# EAGLE design vco__amp_twg (EAGLE 9.6.2)
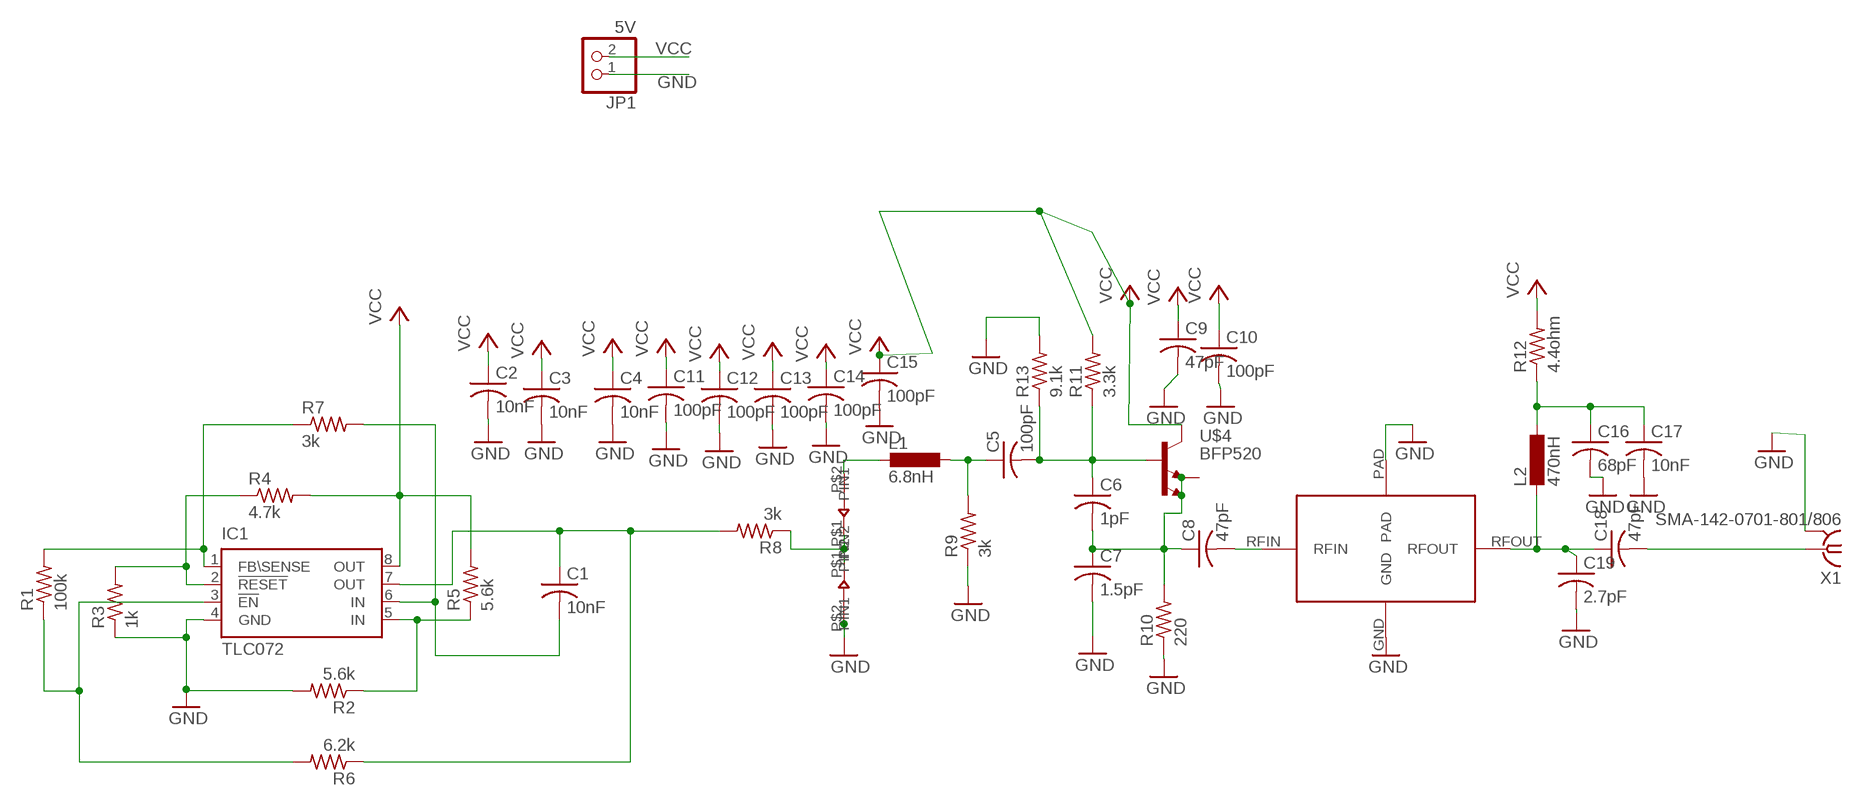
[diagram p0: schematic, sheet 1]

## Parts
C1  10nF  C-USC0603  [C0603]
C2  10nF  C-USC0603  [C0603]
C3  10nF  C-USC0603  [C0603]
C4  10nF  C-USC0603  [C0603]
C5  100pF  C-USC0603  [C0603]
C6  1pF  C-USC0603  [C0603]
C7  1.5pF  C-USC0603  [C0603]
C8  47pF  C-USC0603  [C0603]
C9  47pF  C-USC0603  [C0603]
C10  100pF  C-USC0603  [C0603]
C11  100pF  C-USC0603  [C0603]
C12  100pF  C-USC0603  [C0603]
C13  100pF  C-USC0603  [C0603]
C14  100pF  C-USC0603  [C0603]
C15  100pF  C-USC0603  [C0603]
C16  68pF  C-USC0603  [C0603]
C17  10nF  C-USC0603  [C0603]
C18  47pF  C-USC0603  [C0603]
C19  2.7pF  C-USC0603  [C0603]
IC1  TLC072  TPS77301  [SOP-08]
JP1  5V  PINHD-1X2  [1X02]
L1  6.8nH  L-EUL0603  [L0603]
L2  470nH  L-EUL0603  [L0603]
R1  100k  R-US_R0603  [R0603]
R2  5.6k  R-US_R0603  [R0603]
R3  1k  R-US_R0603  [R0603]
R4  4.7k  R-US_R0603  [R0603]
R5  5.6k  R-US_R0603  [R0603]
R6  6.2k  R-US_R0603  [R0603]
R7  3k  R-US_R0603  [R0603]
R8  3k  R-US_R0603  [R0603]
R9  3k  R-US_R0603  [R0603]
R10  220  R-US_R0603  [R0603]
R11  3.3k  R-US_R0603  [R0603]
R12  4.4ohm  R-US_R0603  [R0603]
R13  9.1k  R-US_R0603  [R0603]
U$1  BBY5702  [BBY5702]
U$2  MMG3001  [SOT-89]
U$4  BFP520  [SOT343]
U$5  BBY5702  [BBY5702]
X1  SMA-142-0701-801/806  [J502-ND-142-0701-801/806]

## Nets
GND: C2.2 C3.2 C4.2 C7.2 C9.2 C10.2 C11.2 C12.2 C13.2 C14.2 C15.2 C16.2 C17.2 C19.2 IC1.4(GND) JP1.1 R2.2 R3.1 R9.1 R10.1 R13.2 U$2.GND U$2.PAD U$5.P$2(PIN2) X1.G@1 X1.G@2 X1.G@3 X1.G@4
N$1: IC1.1(FB\SENSE) R1.2 R7.1
N$2: IC1.3(!EN) R1.1 R6.2
N$3: C8.2 U$2.RFIN
N$4: IC1.5(IN) R2.1 R5.1
N$5: IC1.2(!RESET) R3.2 R4.1
N$6: L1.2 U$1.P$2(PIN2)
N$7: C1.1 IC1.7(OUT) R6.1 R8.2
N$8: C1.2 IC1.6(IN) R7.2
N$9: C5.1 L1.1 R9.2
N$10: C16.1 C17.1 L2.1 R12.1
N$11: C5.2 C6.1 R11.1 R13.1 U$4.1(B)
N$12: R8.1 U$1.P$1(PIN1) U$5.P$1(PIN1)
N$15: C18.1 C19.1 L2.2 U$2.RFOUT
N$16: C18.2 X1.1
N$17: C6.2 C7.1 C8.1 R10.2 U$4.2(E1) U$4.4(E2)
VCC: C2.1 C3.1 C4.1 C9.1 C10.1 C11.1 C12.1 C13.1 C14.1 C15.1 IC1.8(OUT) JP1.2 R4.2 R5.2 R11.2 R12.2 U$4.3(C)

## Library data of the parts
C1-C18 = resistor:C-US: CAPACITOR, American symbol
C19 = rcl-2:C-US: CAPACITOR, American symbol
IC1 = texas:TPS773*: 250-mA LDO REGULATORS WITH RESET OUTPUT WITH 8-PIN MSOP PACKAGING Source: http://focus.ti.com/lit/ds/symlink/tps77333.pdf; MF: TEXAS INSTRUMENT CONNECTORS; MPN: TPS77301DGK; OC_FARNELL: 1510194; OC_NEWARK: 77C1213
JP1 = pinhead:PINHD-1X2: PIN HEADER; JUMPER: Suuply
L1 L2 = rcl-2:L-EU: INDUCTOR, European symbol
R1-R13 = resistor:R-US_: RESISTOR, American symbol
U$1 U$5 = BBY57-02W:BBY5702
U$2 = mmg3001:MMG3001
U$4 = IFXRFNPN:BFP520
X1 = con-coax:SMA-: SMA 50 Ohm End Launch Jack Receptacle - Round Contact Johnson Components Source: www.johnsoncomponents.com .. J502-ND.pdf; MF: JOHNSON COMPONENTS; MPN: 142-0701-801; OC_FARNELL: 1608592; OC_NEWARK: 90F2624

## Net classes
0 default: width 0.305 mm, drill 0.508 mm, clearance 0.254 mm

## Board
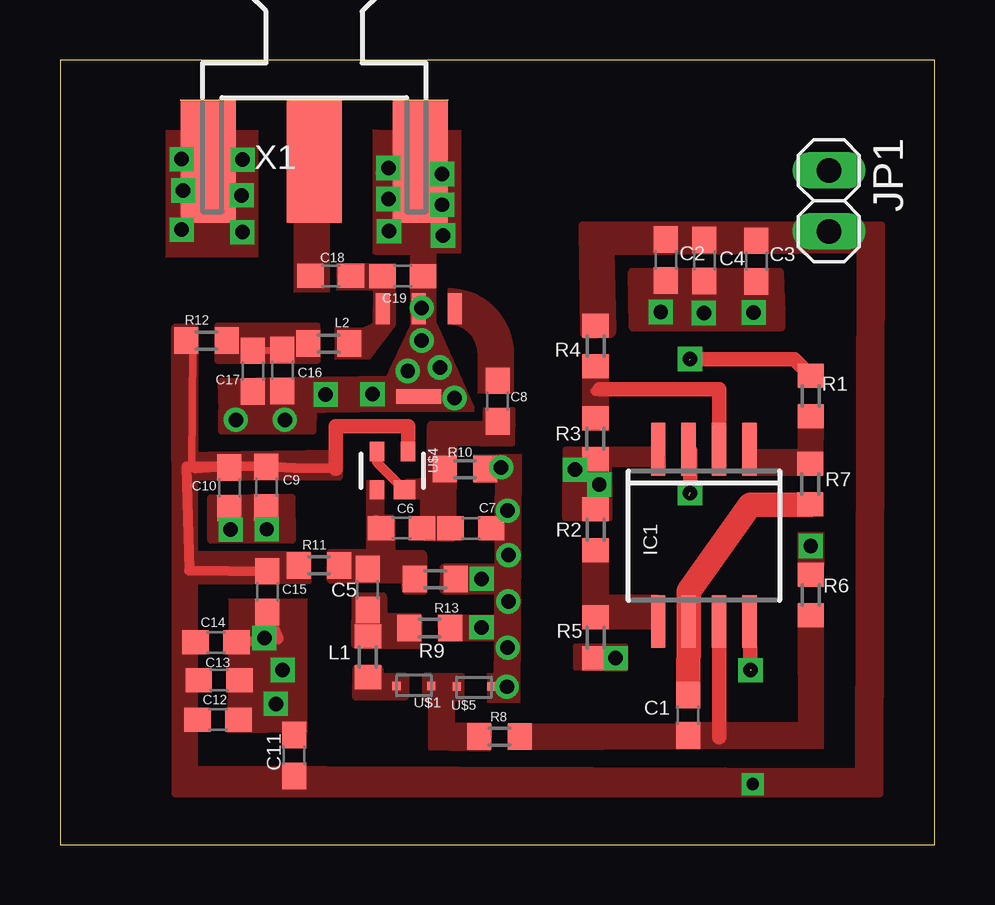
[diagram p1: board, top side]
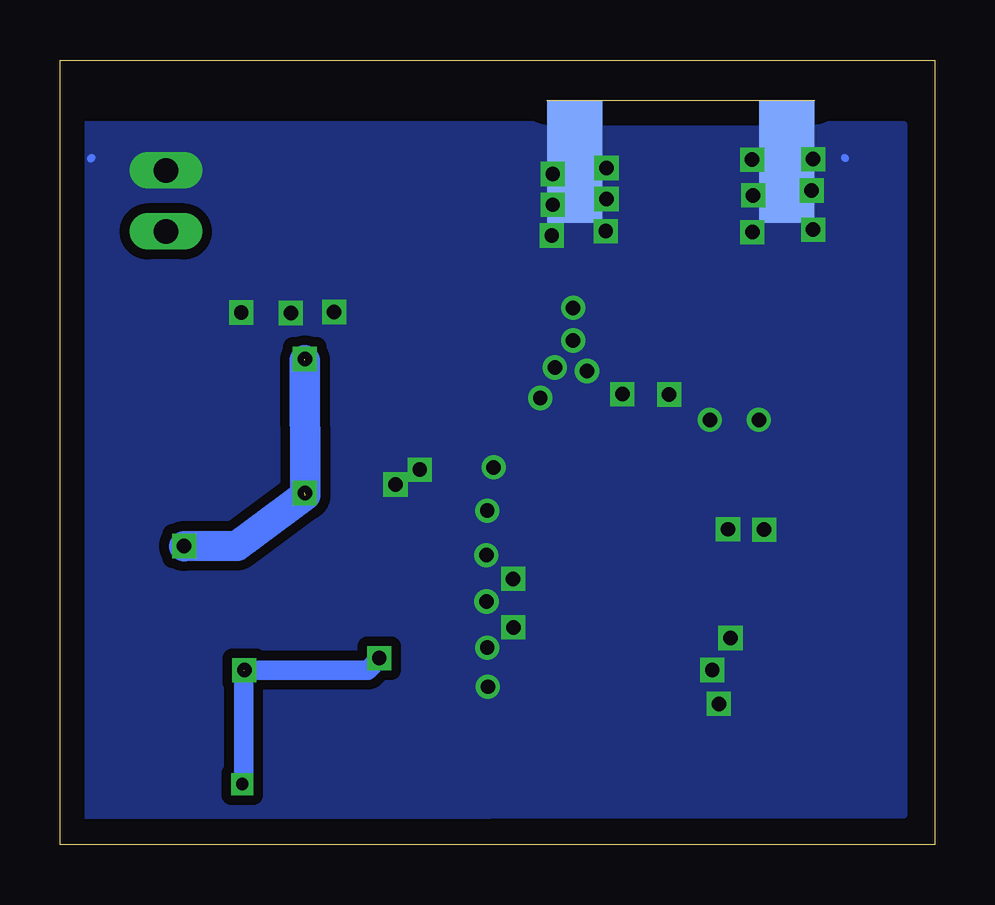
[diagram p2: board, bottom side, seen from below]

Size 36.45 x 32.7 mm. Coordinates in mm from the lower left corner, seen from the top.
Outline: 0,0 36.45,0 36.45,32.7 0,32.7 0,0
Copper layers (1*16): Top 0.035mm / dielectric 1.5mm / Bottom 0.035mm
Design rules "default *": minimum track width 6mil, minimum drill 15mil, track to track 6mil, track to pad 6mil, pad to pad 6mil, via to via 6mil, smd to smd 0mil, copper to edge 40mil, drill to drill 8mil, minimum pad ring 10mil, minimum via ring 8mil, stop-mask expansion 4mil, vias tented up to drill 0mil, thermal gap 10mil

### Footprints (pad centres in the part's own frame; a part is rotated, then mirrored left to right if it is on the bottom)
C0603 = smd 1.1 x 1: 1 -0.85,0; 2 0.85,0
SOP-08 = smd 0.6 x 2.2: 1 -1.905,-3.6; 2 -0.635,-3.6; 3 0.635,-3.6; 4 1.905,-3.6; 5 1.905,3.575; 6 0.635,3.575; 7 -0.635,3.575; 8 -1.905,3.575
1X02 = drill 1.016 long: 1 -1.27,0; 2 1.27,0
L0603 = smd 1 x 1.1: 1 -0.85,0; 2 0.85,0
R0603 = smd 1 x 1.1: 1 -0.85,0; 2 0.85,0
BBY5702 = smd 0.35 x 0.35: P$1 0,0.73; P$2 0,-0.72
SOT-89 = smd 0.58 x 1.3: GND 0,-2; RFIN -1.5,-2; RFOUT 1.5,-2 | smd 1.87 x 0.6: PAD 0,1.65
SOT343 = smd 0.6 x 0.8: 1 -0.65,-0.8; 3 0.65,0.8; 4 -0.65,0.8 | smd 0.9 x 0.8: 2 0.5,-0.8
J502-ND-142-0701-801/806 = smd 5.08 x 2.286: 1 2.565,0; G@1 2.565,4.42; G@2 2.565,-4.42 | smd 5.08 x 2.286 bottom: G@3 2.565,4.42; G@4 2.565,-4.42

### Placement (x,y rotation side)
C1  26.17,5.4 90 top
C2  25.25,24.36 270 top
C3  29.02,24.32 270 top
C4  26.85,24.34 270 top
C5  12.82,10.63 90 top
C6  14.23,13.2 0 top
C7  17.12,13.18 0 top
C8  18.24,18.48 90 top
C9  8.59,14.9 270.1 top
C10  7.05,14.88 270 top
C11  9.76,3.73 90 top
C12  6.58,5.21 0 top
C13  6.63,6.86 0 top
C14  6.5,8.43 0 top
C15  8.64,10.55 270 top
C16  9.26,19.77 270 top
C17  8.03,19.73 270 top
C18  11.28,23.71 180 top
C19  14.28,23.7 0 top
IC1  26.83,12.88 180 top
JP1  32.04,26.83 270 top
L1  12.82,7.83 270 top
L2  11.2,20.89 0 top
R1  31.28,18.7 270 top
R2  22.32,13.13 90 top
R3  22.31,16.91 90 top
R4  22.32,20.79 90 top
R5  22.32,8.63 270 top
R6  31.28,10.41 90 top
R7  31.26,15.03 270 top
R8  18.31,4.5 0 top
R9  15.4,9.04 180 top
R10  16.88,15.65 180 top
R11  10.79,11.64 180 top
R12  6.11,21 180 top
R13  15.64,11.07 0 top
U$1  14.74,6.61 270 top
U$2  14.95,20.33 180 top
U$4  13.85,15.59 0 top
U$5  17.26,6.59 90 top
X1  10.59,31.03 270 top

### Tracks (layer width: path | path; a pad name or v marks a point on that pad's centre or on a via)
GND  (via drill 0.6)
  Top 0.406: C14.2 9.11,8.57 C15.2 | 22.56,14.66 22.45,14.69 | 5.19,28.3 4.93,28.29 | 14.76,28 13.35,28
  Bottom 0.305: 14.92,27.21 | 35.13,28.62 35.16,28.59 | X1.G@1 15.18,29.56 | 3.75,28.63 3.73,28.61
  other vias: 18.68,10.14 18.65,8.21 18.62,6.58 18.68,12.07 18.65,13.93 8.62,13.15 7.11,13.13 8.52,8.62 9.28,7.29 18.38,15.72 9.37,17.7 7.33,17.7 8.99,5.87 15.07,22.37 21.46,15.63 22.47,15.01 17.57,11.08 15.07,21.01 16.44,18.61 15.83,19.89 14.49,19.74 13.02,18.78 11.07,18.76 15.96,25.39 15.92,26.67 15.92,27.95 13.68,28.2 13.68,26.91 13.71,25.57 7.57,27.06 5.07,25.63 5.13,27.26 5.07,28.57 7.6,25.53 7.61,28.55 25.03,22.2 26.83,22.16 28.9,22.18 17.56,9.06
  pour Top (no thermals): 7.03,10.26 10.31,10.26 10.3,4.69 6.98,4.64
  pour Top (no thermals): 18.13,16.28 19.23,16.28 19.18,5.92 18.08,5.92
  pour Top (no thermals): 23.87,23.85 29.95,23.84 30.03,21.59 23.91,21.57
  pour Top (no thermals): 21.09,16.43 22.84,16.44 22.86,13.62 21.08,13.64
  pour Top (no thermals): 6.34,14.4 9.6,14.45 9.62,12.75 6.34,12.75
  pour Top (no thermals): 6.72,19.29 6.75,18.08 13.92,18.19 13.88,19.39
  pour Top (no thermals): 4.44,24.5 4.44,29.76 8.21,29.76 8.21,24.5
  pour Top (no thermals): 16.03,11.51 16.02,10.64 18.59,10.65 18.56,11.5
  pour Top (no thermals): 17.22,15.08 18.13,15.08 18.13,16.28 17.22,16.26
  pour Top (no thermals): 13.1,18.17 17.18,18.14 15.61,21.64 14.71,21.61
  pour Top (no thermals): 15.58,21.69 15.58,24.62 13.13,29.73 13.13,24.71 14.7,24.69 14.7,21.7
  pour Top (no thermals): 21.76,16.59 25.21,16.6 25.23,15.76 21.77,15.75
  pour Top (no thermals): 15.74,9.59 18.18,9.59 18.21,8.49 15.76,8.48
  pour Top (no thermals): 17.81,7.14 19.03,7.14 19.03,5.92 17.81,5.92
  pour Bottom (isolate 0.406, rank 2, no thermals): 35.7,30 35.7,1.21 1.3,1.25 1.3,30
  pour Top (no thermals): 6.73,18.11 6.73,17.26 10.54,17.25 10.55,18.11
  pour Top (no thermals): 13.1,24.67 13.1,29.75 16.67,29.75 16.67,24.67
N$1
  Top 0.305: 31.15,15.81 R7.1
  pour Top (no thermals): 28.44,16.48 28.44,15.38 31.81,15.38 31.83,18.35 30.73,18.35 30.74,16.48
N$2  (via drill 0.6)  (2 unrouted)
  Top 0.305: 31.38,11.43 R6.2 31.1,11.15
  Top 0.406: R1.1 31.29,19.59 | IC1.3 arc-90 26.25,16.43
  Top 0.61: 26.25,16.43 v26.25,14.66 | v26.25,20.24 30.59,20.24 R1.1
  Bottom 0: 26.23,14.66 v26.25,14.66
  Bottom 1.27: 26.23,14.56 29.07,12.47 v31.28,12.45 | 26.25,20.18 26.23,14.66
  pour Top (no thermals): 30.73,11.64 30.73,13.02 31.84,13.02 31.84,11.64
N$3
  pour Top (no thermals): 17.4,18.82 18.91,18.82 18.91,18.89 18.91,20.44 arc90 16.15,23.2 16.15,21.7 arc-90 17.4,20.45
N$4
  pour Top (no thermals): 21.77,12.78 22.87,12.78 22.87,8.98 21.77,8.98
  pour Top (no thermals): 24.88,10.41 22.19,10.42 22.23,8.98 24.9,8.98 24.91,10.41
N$5
  Top 0.406: 22.33,17.86 R3.2 | 22.31,18.91 22.44,18.91 arc-90 22.5,18.97
  Top 0.61: IC1.2 27.46,18.97 22.5,18.97
  pour Top (no thermals): 21.76,20.44 22.87,20.44 22.87,17.26 21.75,17.26 21.76,20.43
N$6
  pour Top (no thermals): 13.25,7.35 13.26,6.96 14.34,6.97 14.35,6.22 12.38,6.19 12.41,7.34
N$7
  Top 0.61: IC1.7 27.47,4.48
  pour Top (no thermals): 19.67,5.06 25.66,5.05 25.66,5.12 26.68,5.12 26.65,5.11 30.76,5.11 30.73,9.08 31.83,9.09 31.82,4 26.68,3.98 18.66,3.95 18.66,5.06
N$8
  Top 0.305: 31.27,14.17 R7.2
  Top 0.61: 26.21,10.56 arc90 26.2,10.56
  Top 1.016: 31.27,14.17 28.76,14.17 26.21,10.56 | C1.2 IC1.6 26.2,10.56
N$9
  pour Top (no thermals): 13.42,10.32 13.42,9.47 14.9,9.47 14.87,8.34 12.34,8.36 12.37,10.33
N$10
  Top 0.305: C17.1 C16.1
  pour Top (no thermals): 6.6,21.6 10.7,21.6 10.7,20.2 6.6,20.2
N$11
  Top 0.406: 12.82,11.65 C5.2 | 13.16,13.54 C6.1
  pour Top (no thermals): 11.3,12.11 11.29,11.1 15.09,11.1 15.09,12.07 13.79,12.07 13.79,13.55 12.95,13.55 12.95,12.11
  pour Top (no thermals): 14.41,12.07 15.09,12.06 15.12,10.62 14.45,10.62
  pour Top (no thermals): 12.76,15.2 13.5,15.19 13.51,13.6 12.75,13.57
N$12
  pour Top (no thermals): 15.2,7.04 15.2,6.11 16.74,6.11 16.74,7.03
  pour Top (no thermals): 16.33,6.17 16.33,4.99 17.86,5 17.84,3.99 15.46,4.04 15.46,6.16
N$15
  pour Top (no thermals): 11.52,24.23 13.98,24.23 13.98,21.65 12.9,20.23 11.45,20.23 11.45,21.54 12.61,21.54 13.04,21.74 13.05,23.1 11.53,23.1
N$16
  pour Top (no thermals): 11.23,23.02 11.21,29.74 9.73,29.74 9.73,23.02
N$17
  Top 0.406: U$4.4 13.2,15.94 U$4.2
  pour Top (no thermals): 15.47,17.32 15.47,15.09 14.47,15.05 14.47,14.61 15.19,14.61 15.2,12.88 16.31,12.82 16.37,16.83 18.6,16.8 18.61,17.45 15.49,17.47
  pour Top (no thermals): 17.72,18.11 17.69,16.73 18.85,16.74 18.87,18.12
VCC  (via drill 0.51, 0.6)  (1 unrouted)
  Top 0.305: C10.1 5.63,15.63 5.48,15.79 5.54,20.73 R12.2
  Top 0.406: U$4.3 14.51,16.57 | 11.49,15.67 9.78,15.7 C9.1 5.27,15.77 5.38,11.43 C15.1
  Top 0.61: v28.77,7.28 IC1.8 | 14.51,16.57 14.51,17.45 11.49,17.44 11.49,15.67
  Bottom 0.813: v23.15,7.78 23.62,7.28 v28.77,7.28 | v28.86,2.53 28.86,2.73 28.8,2.86 28.8,7.27
  pour Top (no thermals): 22.98,21.46 22.9,24.78 33.38,24.86 33.32,2.99 5.55,3.09 5.55,15.4 11.59,15.37 11.59,16.25 4.85,16.14 4.85,2.16 34.12,2.18 34.18,25.78 21.8,25.76 21.87,21.3 22.95,21.34
  pour Top (no thermals): 5.55,16 4.85,16 4.85,21.54 5.55,21.53 5.55,20.28 5.55,16.02
  pour Top (no thermals): 10.35,10.98 5.69,10.94 5.67,12.13 10.34,12.15
  pour Top (no thermals): 23.55,8.28 23.55,7.34 21.84,7.35 21.5,7.37 21.5,8.29